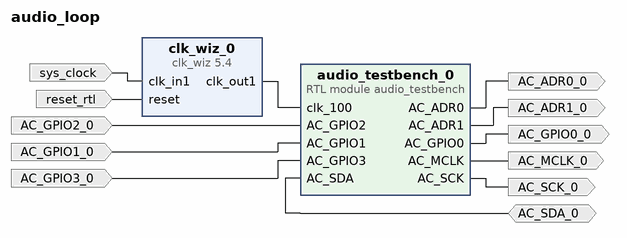
[diagram p0: block diagram of the top level]
# Vivado block design audio_loop, xc7z020clg484-1, Vivado 2017.3
create_bd_design audio_loop

create_bd_port -dir I -type clk sys_clock
set_property -dict {CONFIG.FREQ_HZ 100000000 CONFIG.PHASE 0.000} [get_bd_ports sys_clock]
create_bd_port -dir IO AC_SDA_0
create_bd_port -dir O AC_SCK_0
create_bd_port -dir O AC_MCLK_0
create_bd_port -dir I AC_GPIO2_0
create_bd_port -dir I AC_GPIO1_0
create_bd_port -dir O AC_GPIO0_0
create_bd_port -dir O AC_ADR1_0
create_bd_port -dir O AC_ADR0_0
create_bd_port -dir I AC_GPIO3_0
create_bd_port -dir I -type rst reset_rtl
set_property -dict {CONFIG.POLARITY ACTIVE_HIGH} [get_bd_ports reset_rtl]

create_bd_cell -type ip -vlnv xilinx.com:ip:clk_wiz:5.4 clk_wiz_0
set_property -dict {CONFIG.USE_BOARD_FLOW true CONFIG.CLK_IN1_BOARD_INTERFACE sys_clock} [get_bd_cells clk_wiz_0]
create_bd_cell -type module -reference audio_testbench audio_testbench_0

# ---- connections ----

connect_bd_net [get_bd_ports sys_clock] [get_bd_pins clk_wiz_0/clk_in1]
connect_bd_net [get_bd_pins clk_wiz_0/clk_out1] [get_bd_pins audio_testbench_0/clk_100]
connect_bd_net [get_bd_ports AC_SDA_0] [get_bd_pins audio_testbench_0/AC_SDA]
connect_bd_net [get_bd_pins audio_testbench_0/AC_SCK] [get_bd_ports AC_SCK_0]
connect_bd_net [get_bd_pins audio_testbench_0/AC_MCLK] [get_bd_ports AC_MCLK_0]
connect_bd_net -net AC_GPIO2_0_1 [get_bd_ports AC_GPIO2_0] [get_bd_pins audio_testbench_0/AC_GPIO2]
connect_bd_net -net AC_GPIO1_0_1 [get_bd_ports AC_GPIO1_0] [get_bd_pins audio_testbench_0/AC_GPIO1]
connect_bd_net [get_bd_pins audio_testbench_0/AC_GPIO0] [get_bd_ports AC_GPIO0_0]
connect_bd_net [get_bd_pins audio_testbench_0/AC_ADR1] [get_bd_ports AC_ADR1_0]
connect_bd_net [get_bd_pins audio_testbench_0/AC_ADR0] [get_bd_ports AC_ADR0_0]
connect_bd_net -net AC_GPIO3_0_1 [get_bd_ports AC_GPIO3_0] [get_bd_pins audio_testbench_0/AC_GPIO3]
connect_bd_net [get_bd_ports reset_rtl] [get_bd_pins clk_wiz_0/reset]

validate_bd_design
save_bd_design
